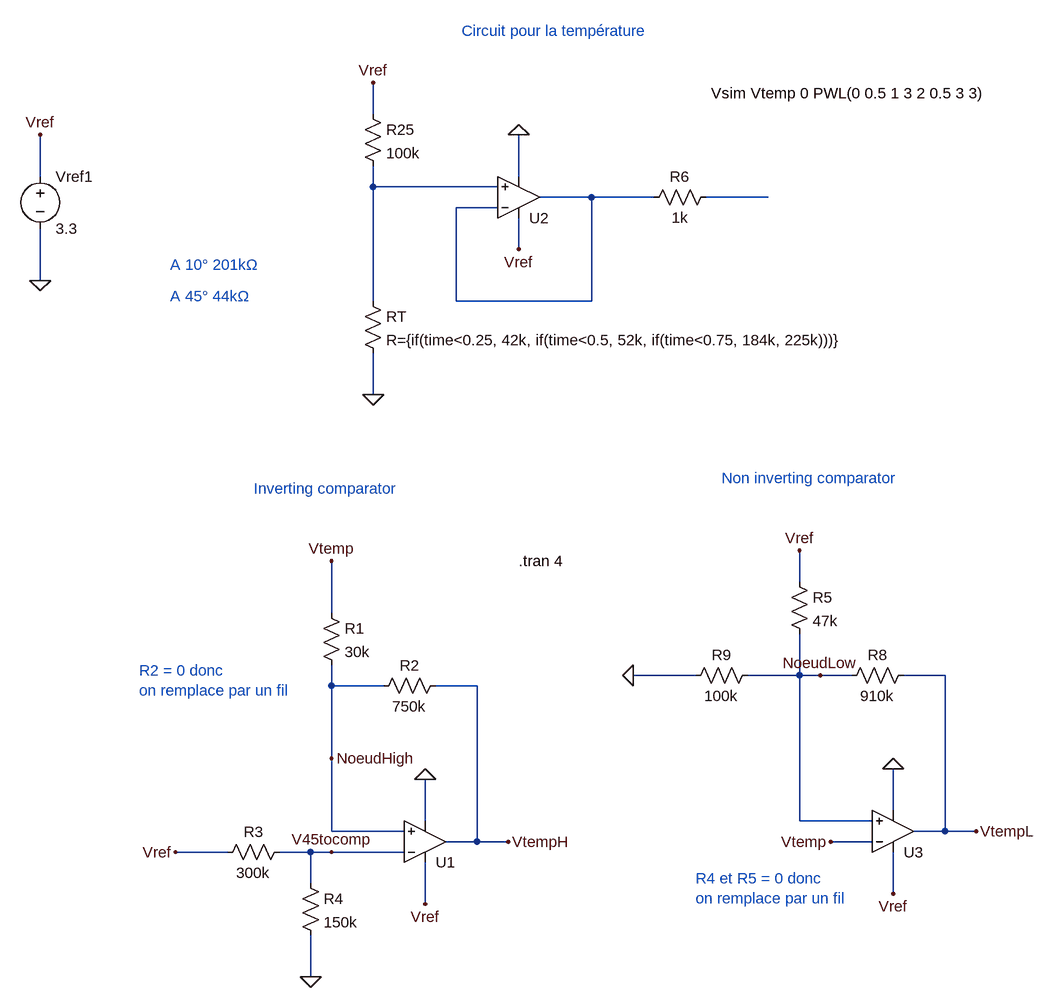
[diagram p0: schematic Ctrl_temp.asc]
Ctrl_temp.asc, the LTspice schematic file:
Version 4.1
SHEET 1 1480 1220
WIRE 48 -448 48 -496
WIRE -464 -352 -464 -416
WIRE 272 -352 272 -416
WIRE 48 -336 48 -368
WIRE 240 -336 48 -336
WIRE 384 -320 304 -320
WIRE 480 -320 384 -320
WIRE 656 -320 560 -320
WIRE 240 -304 176 -304
WIRE 272 -240 272 -288
WIRE -464 -192 -464 -272
WIRE 48 -160 48 -336
WIRE 176 -160 176 -304
WIRE 384 -160 384 -320
WIRE 384 -160 176 -160
WIRE 48 -16 48 -80
WIRE 704 272 704 224
WIRE -16 320 -16 240
WIRE 544 416 448 416
WIRE 704 416 704 352
WIRE 704 416 624 416
WIRE 736 416 704 416
WIRE 784 416 736 416
WIRE 928 416 864 416
WIRE -16 432 -16 400
WIRE 64 432 -16 432
WIRE 208 432 144 432
WIRE -16 544 -16 432
WIRE 848 624 848 560
WIRE 128 640 128 576
WIRE 704 640 704 416
WIRE 816 640 704 640
WIRE -16 656 -16 544
WIRE 96 656 -16 656
WIRE 928 656 928 416
WIRE 928 656 880 656
WIRE 976 656 928 656
WIRE 208 672 208 432
WIRE 208 672 160 672
WIRE 256 672 208 672
WIRE 816 672 752 672
WIRE -176 688 -256 688
WIRE -48 688 -96 688
WIRE -16 688 -48 688
WIRE 96 688 -16 688
WIRE -48 736 -48 688
WIRE 848 752 848 688
WIRE 128 768 128 704
WIRE -48 880 -48 816
FLAG 272 -416 0
FLAG 48 -16 0
FLAG 48 -496 Vref
FLAG 256 672 VtempH
FLAG -256 688 Vref
FLAG -16 240 Vtemp
FLAG 128 576 0
FLAG 128 768 Vref
FLAG -48 880 0
FLAG 976 656 VtempL
FLAG 752 672 Vtemp
FLAG 704 224 Vref
FLAG 848 560 0
FLAG 848 752 Vref
FLAG 736 416 NoeudLow
FLAG -464 -416 Vref
FLAG -464 -192 0
FLAG 448 416 0
FLAG 272 -240 Vref
FLAG -16 688 V45tocomp
FLAG -16 544 NoeudHigh
SYMBOL OpAmps\\UniversalOpAmp2 272 -320 M180
SYMATTR InstName U2
SYMBOL res 32 -464 R0
SYMATTR InstName R25
SYMATTR Value 100k
SYMBOL res 32 -176 R0
SYMATTR InstName RT
SYMATTR Value R={if(time<0.25, 42k, if(time<0.5, 52k, if(time<0.75, 184k, 225k)))}
SYMBOL OpAmps\\UniversalOpAmp2 128 672 M180
SYMATTR InstName U1
SYMBOL res -32 304 R0
SYMATTR InstName R1
SYMATTR Value 30k
SYMBOL res 160 416 R90
WINDOW 0 0 56 VBottom 2
WINDOW 3 32 56 VTop 2
SYMATTR InstName R2
SYMATTR Value 750k
SYMBOL res -80 672 R90
WINDOW 0 0 56 VBottom 2
WINDOW 3 32 56 VTop 2
SYMATTR InstName R3
SYMATTR Value 300k
SYMBOL res -64 720 R0
SYMATTR InstName R4
SYMATTR Value 150k
SYMBOL OpAmps\\UniversalOpAmp2 848 656 M180
SYMATTR InstName U3
SYMBOL res 688 256 R0
SYMATTR InstName R5
SYMATTR Value 47k
SYMBOL res 880 400 R90
WINDOW 0 0 56 VBottom 2
WINDOW 3 32 56 VTop 2
SYMATTR InstName R8
SYMATTR Value 910k
SYMBOL voltage -464 -368 R0
WINDOW 123 0 0 Left 0
WINDOW 39 0 0 Left 0
SYMATTR InstName Vref1
SYMATTR Value 3.3
SYMBOL res 640 400 R90
WINDOW 0 0 56 VBottom 2
WINDOW 3 32 56 VTop 2
SYMATTR InstName R9
SYMATTR Value 100k
SYMBOL res 576 -336 R90
WINDOW 0 0 56 VBottom 2
WINDOW 3 32 56 VTop 2
SYMATTR InstName R6
SYMATTR Value 1k
TEXT -136 128 Left 2 ;Inverting comparator
TEXT 584 112 Left 2 ;Non inverting comparator
TEXT 272 240 Left 2 !.tran 4
TEXT 544 728 Left 2 ;R4 et R5 = 0 donc \non remplace par un fil
TEXT -312 408 Left 2 ;R2 = 0 donc \non remplace par un fil
TEXT 184 -576 Left 2 ;Circuit pour la température
TEXT -264 -216 Left 2 ;A 10° 201kΩ
TEXT -264 -168 Left 2 ;A 45° 44kΩ
TEXT 568 -480 Left 2 !Vsim Vtemp 0 PWL(0 0.5 1 3 2 0.5 3 3)

The netlist it stands for:
* Ctrl_temp.asc
X§U2 N001 N002 Vref 0 N002 level2 Avol=1Meg GBW=10Meg Slew=10Meg Ilimit=25m Rail=0 Vos=0 En=0 Enk=0 In=0 Ink=0 Rin=500Meg  ; pins In+ In- V+ V- OUT
R25 Vref N001 100k
RT N001 0 R={if(time<0.25, 42k, if(time<0.5, 52k, if(time<0.75, 184k, 225k)))}
X§U1 NoeudHigh V45tocomp Vref 0 VtempH level2 Avol=1Meg GBW=10Meg Slew=10Meg Ilimit=25m Rail=0 Vos=0 En=0 Enk=0 In=0 Ink=0 Rin=500Meg  ; pins In+ In- V+ V- OUT
R1 Vtemp NoeudHigh 30k
R2 VtempH NoeudHigh 750k
R3 V45tocomp Vref 300k
R4 V45tocomp 0 150k
X§U3 NoeudLow Vtemp Vref 0 VtempL level2 Avol=1Meg GBW=10Meg Slew=10Meg Ilimit=25m Rail=0 Vos=0 En=0 Enk=0 In=0 Ink=0 Rin=500Meg  ; pins In+ In- V+ V- OUT
R5 Vref NoeudLow 47k
R8 VtempL NoeudLow 910k
Vref1 Vref 0 3.3
R9 NoeudLow 0 100k
R6 N003 N002 1k
* Inverting comparator
* Non inverting comparator
.tran 4
* R4 et R5 = 0 donc
* on remplace par un fil
* R2 = 0 donc
* on remplace par un fil
* Circuit pour la température
* A 10° 201kΩ
* A 45° 44kΩ
Vsim Vtemp 0 PWL(0 0.5 1 3 2 0.5 3 3)
.lib UniversalOpAmp2.lib
.backanno
.end